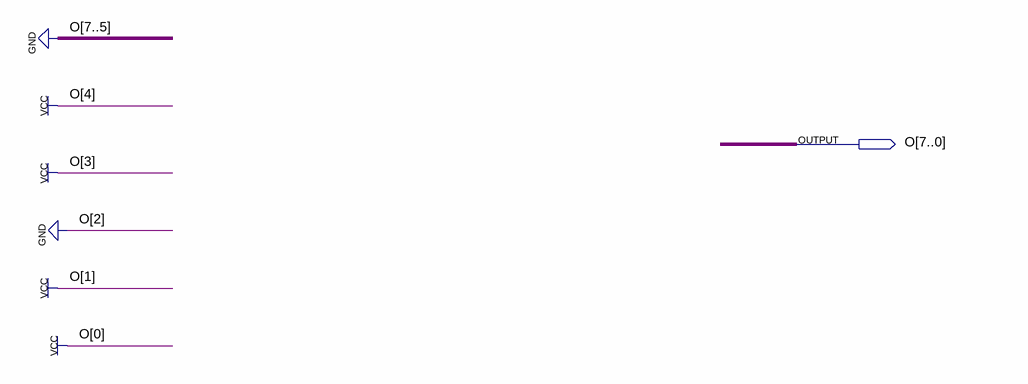
[diagram p0: schematic sheet]
// Quartus schematic 1B.bdf as structural Verilog: 0 symbols, 1 pins
module \1B  (
  output [7:0] O
);


  assign O = 8'b00011011;
endmodule
